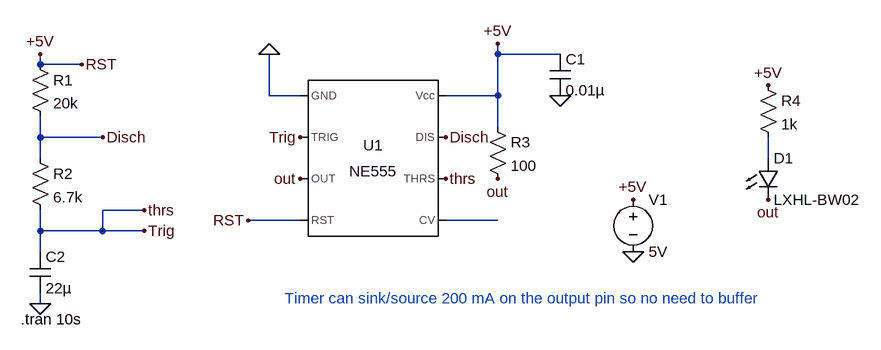
[diagram p0: schematic Timer LTSpice Schematic.asc]
Timer LTSpice Schematic.asc, the LTspice schematic file:
Version 4
SHEET 1 1000 680
WIRE 432 -16 432 -32
WIRE 528 -16 432 -16
WIRE -272 0 -272 -16
WIRE -208 0 -272 0
WIRE 80 48 80 -16
WIRE 128 48 80 48
WIRE 432 48 432 -16
WIRE 432 48 352 48
WIRE 432 96 432 48
WIRE -272 112 -272 80
WIRE -176 112 -272 112
WIRE -272 144 -272 112
WIRE 848 144 848 112
WIRE -112 224 -176 224
WIRE 128 240 48 240
WIRE 432 240 352 240
WIRE -272 256 -272 224
WIRE -176 256 -176 224
WIRE -176 256 -272 256
WIRE -112 256 -176 256
WIRE -272 288 -272 256
WIRE -272 368 -272 352
FLAG 640 288 0
FLAG 640 208 +5V
FLAG 432 -32 +5V
FLAG 528 48 0
FLAG 128 176 out
FLAG 48 240 RST
FLAG 128 112 Trig
FLAG 80 -16 0
FLAG 352 112 Disch
FLAG 352 176 thrs
FLAG -272 -16 +5V
FLAG -272 368 0
FLAG -208 0 RST
FLAG -176 112 Disch
FLAG -112 224 thrs
FLAG -112 256 Trig
FLAG 432 176 out
FLAG 848 32 +5V
FLAG 848 208 out
SYMBOL Misc\\NE555 240 144 R0
SYMATTR InstName U1
SYMBOL voltage 640 192 R0
SYMATTR InstName V1
SYMATTR Value 5V
SYMBOL cap 512 -16 R0
SYMATTR InstName C1
SYMATTR Value 0.01µ
SYMBOL res -288 -16 R0
SYMATTR InstName R1
SYMATTR Value 20k
SYMBOL res -288 128 R0
SYMATTR InstName R2
SYMATTR Value 6.7k
SYMBOL cap -288 288 R0
SYMATTR InstName C2
SYMATTR Value 22µ
SYMBOL res 416 80 R0
SYMATTR InstName R3
SYMATTR Value 100
SYMBOL res 832 16 R0
SYMATTR InstName R4
SYMATTR Value 1k
SYMBOL LED 832 144 R0
SYMATTR InstName D1
SYMATTR Value LXHL-BW02
SYMATTR Description Diode
SYMATTR Type diode
TEXT -302 392 Left 2 !.tran 10s
TEXT 104 360 Left 2 ;Timer can sink/source 200 mA on the output pin so no need to buffer

The netlist it stands for:
* Timer LTSpice Schematic.asc
XU1 0 thrs out RST N002 thrs Disch RST NE555  ; pins GND TRIG OUT RST CV THRS DIS Vcc
V1 RST 0 5V
C1 RST 0 0.01µ
R1 RST Disch 20k
R2 Disch thrs 6.7k
C2 thrs 0 22µ
R3 RST out 100
R4 RST N001 1k
D1 N001 out LXHL-BW02
.model D D
.lib standard.dio
.tran 10s
* Timer can sink/source 200 mA on the output pin so no need to buffer
.lib NE555.sub
.backanno
.end